# Altium schematic sheet Cap 4.7uF 16V.schdoc
size 127 x 101 mm
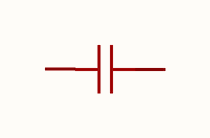
[diagram p0: Cap 4.7uF 16V.schdoc]

## Parts
C?  4.7uF  [C0603]  (value not drawn)

## Nets

Not connected (* = marked no-connect by the designer): C? 1 2

## Library data of the parts
C? = GRM188C71C475KE21D: Manufacturer: muRata(村田); Add into BOM: yes; Tolerance: ±10%; Symbol: GRM188C71C475KE21D; Device: GRM188C71C475KE21D; LCSC Part Name: 4.7uF ±10% 16V; Supplier Part: C237615; Manufacturer Part: GRM188C71C475KE21D; Supplier Footprint: 0603; JLCPCB Part Class: Extended Part; Datasheet: https://atta.szlcsc.com/upload/public/pdf/source/20200305/C490387_23319AE8C154DEB24C505E6C82A8106A.pdf; Supplier: LCSC; Convert to PCB: yes; Value: 4.7uF